# Altium schematic sheet PWR_MT2492.SchDoc
size A3; SheetNumber: 1; SheetTotal: 1
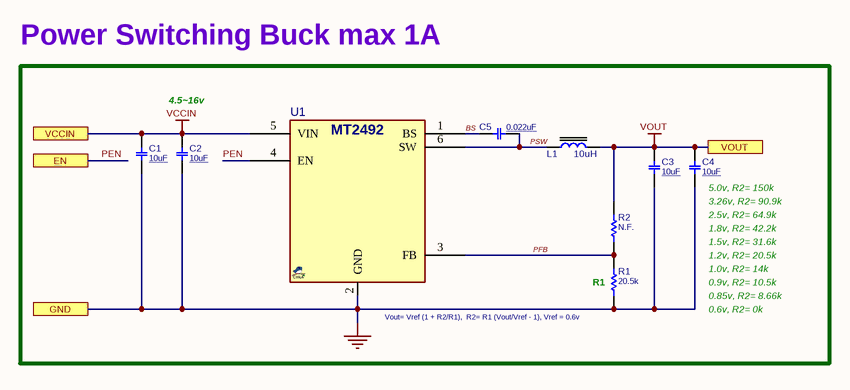
[diagram p0: PWR_MT2492.SchDoc]

## Parts
C1  10uF  [C0603]
C2  10uF  [C0603]
C3  10uF  [C0603]
C4  10uF  [C0603]
C5  0.022uF  [C0603]
L1  10uH  [L1210]
R1  20.5k  [R0603]
R2  N.F.  [R0603]
U1  MT2492  [SOT23_6]  (value not drawn)

## Ports
EN, GND, VCCIN, VOUT

## Nets
GND: C1.2 C2.2 C3.2 C4.2 R1.1 U1.2(GND) ; port GND
VCCIN: C1.1 C2.1 U1.5(VIN) ; port VCCIN
VOUT: C3.1 C4.1 L1.2 R2.2 ; port VOUT
BS: C5.1 U1.1(BS)
PEN: U1.4(EN) ; port EN
PFB: R1.2 R2.1 U1.3(FB)
PSW: C5.2 L1.1 U1.6(SW)

## Notes on the sheet
- Power Switching Buck max 1A
- 4.5~16v
- (near C4) 3.26v, R2= 90.9k
- (near C4) 2.5v, R2= 64.9k
- 1.8v, R2= 42.2k
- (near C4) 5.0v, R2= 150k
- (near R1) R1
- 1.2v, R2= 20.5k
- 1.5v, R2= 31.6k
- 1.0v, R2= 14k
- 0.9v, R2= 10.5k
- 0.85v, R2= 8.66k
- Vout= Vref (1 + R2/R1),  R2= R1 (Vout/Vref - 1), Vref = 0.6v
- 0.6v, R2= 0k

## Library data of the parts
C1-C4 = CAP_SMD_MLCC: CAP, MLCC; PARAM: X5R, 20%; PARAM2: 25v; PRICE: 100= 1$; DESC: CAP, MLCC; MANF_P#: -; MANF: -; ASSEMBLY: ASSEMBLY; VALUE: 10uF
C5 = CAP_SMD_MLCC: CAP, MLCC; PARAM: X5R, 20%; PARAM2: 10v; PRICE: 100= 1$; DESC: CAP, MLCC; MANF_P#: -; MANF: -; ASSEMBLY: ASSEMBLY; VALUE: 0.022uF
L1 = INDPWR_SMD: INDUCTOR, POWER, SMD; MANF: Murata; MANF_P#: DFE322512F-100M; PARAM: 1.1A, 300mDCR; PRICE: 8t@LION; VALUE: 10uH
R1 R2 = RES_SMD: RESISTOR, SMD; PARAM: -W; DESC: DESCRIPTION; DIST#: MOUSER; PARAM2: 1%; MANF_P#: -; MANF: -; ASSEMBLY: ASSEMBLY; PRICE: 100= 0.5$
  R1: VALUE: 20.5k
  R2: VALUE: N.F.
U1 = VREG_MT2492_SOT23: REG, Switching, Buck, 2A, ADJ, 0.6MHz, 4.5~16VIN, SOT23-5; MANF: Aerosemi; PARAM: 2A, 0.6MHz, -40~85°C; PARAM2: 4.5~16VIN, ADJ; ASSEMBLY: ASSEMBLY; PRICE: 2.2t@LION; DESC: -; MANF_P#: MT2492; VALUE: MT2492